# Altium schematic sheet 433_RX.SchDoc
size A4
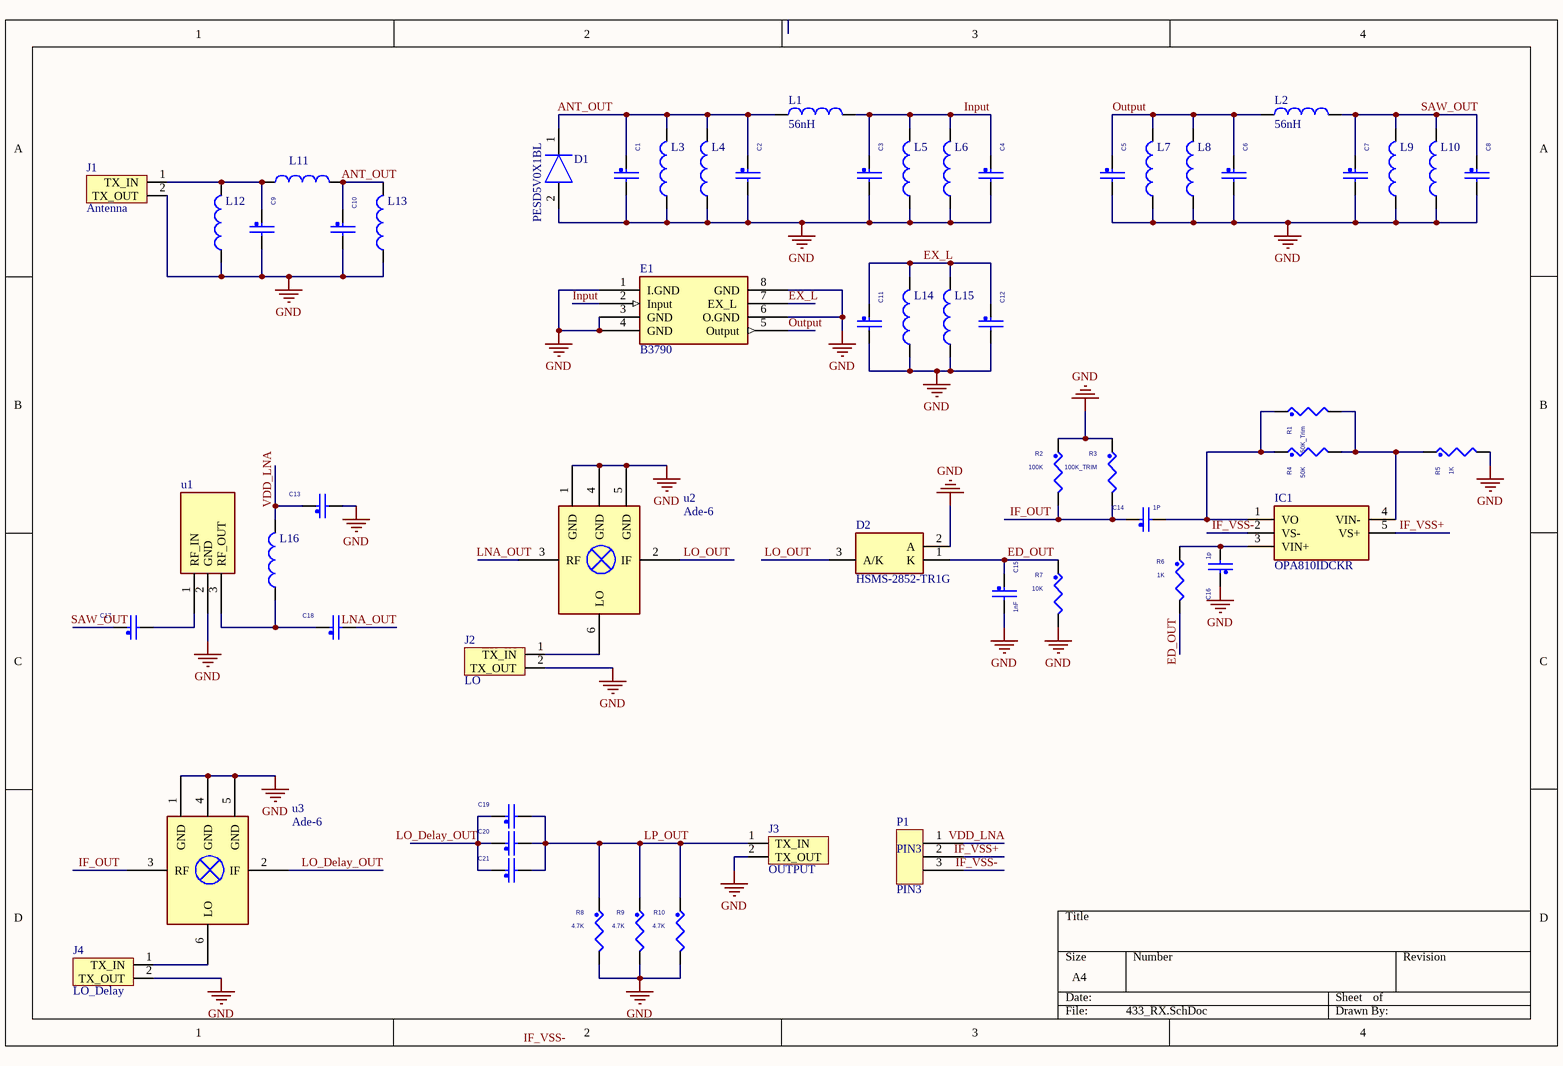
[diagram p0: 433_RX.SchDoc]

## Parts
C1  (no value)  [C0402]
C2  (no value)  [C0402]
C3  (no value)  [C0402]
C4  (no value)  [C0402]
C5  (no value)  [C0402]
C6  (no value)  [C0402]
C7  (no value)  [C0402]
C8  (no value)  [C0402]
C9  (no value)  [C0402]
C10  (no value)  [C0402]
C11  (no value)  [C0402]
C12  (no value)  [C0402]
C13  (no value)  [C0402]
C14  1P  [C0402]
C15  1nF  [C0402]
C16  1p  [C0402]
C17  (no value)  [C0402]
C18  (no value)  [C0402]
C19  (no value)  [C0402]
C20  (no value)  [C0402]
C21  (no value)  [C0402]
D1  PESD5V0X1BL  [PESD5V0X1BL]
D2  HSMS-2852-TR1G  [SOT65P210X110-3N]
E1  B3790  [B3790]
IC1  OPA810IDCKR  [SOT65P210X110-5N]
J1  Antenna  [SMA-2]
J2  LO  [SMA-2]
J3  OUTPUT  [SMA-2]
J4  LO_Delay  [SMA-2]
L1  56nH  [0402-A]
L2  56nH  [0402-A]
L3  (no value)  [0402-A]
L4  (no value)  [0402-A]
L5  (no value)  [0402-A]
L6  (no value)  [0402-A]
L7  (no value)  [0402-A]
L8  (no value)  [0402-A]
L9  (no value)  [0402-A]
L10  (no value)  [0402-A]
L11  56nH  [0402-A]  (value not drawn)
L12  (no value)  [0402-A]
L13  (no value)  [0402-A]
L14  (no value)  [0402-A]
L15  (no value)  [0402-A]
L16  (no value)  [0402-A]
P1  PIN3  [PIN3]
R1  50K_Trim  [R0402]
R2  100K  [R0402]
R3  100K_TRIM  [R0402]
R4  50K  [R0402]
R5  1K  [R0402]
R6  1K  [R0402]
R7  10K  [R0402]
R8  4.7K  [R0402]
R9  4.7K  [R0402]
R10  4.7K  [R0402]
u1  1  [TOP3M9008]  (value not drawn)
u2  Ade-6  [Ade-6]
u3  Ade-6  [Ade-6]

## Nets
GND: C1.2 C2.2 C3.2 C4.2 C5.2 C6.2 C7.2 C8.2 C9.2 C10.2 C11.2 C12.2 C13.2 C15.2 C16.1 D1.2(A) D2.2(A) E1.1(I.GND) E1.3(GND) E1.4(GND) E1.6(O.GND) E1.8(GND) J1.2(TX_OUT) J2.2(TX_OUT) J3.2(TX_OUT) J4.2(TX_OUT) L3.1 L4.1 L5.1 L6.1 L7.1 L8.1 L9.1 L10.1 L12.1 L13.1 L14.1 L15.1 R2.1 R3.1 R5.2 R7.2 R8.2 R9.2 R10.2 u1.2(GND) u2.1(GND) u2.4(GND) u2.5(GND) u3.1(GND) u3.4(GND) u3.5(GND)
ANT_OUT: C1.1 C2.1 C10.1 D1.1(K) L1.1 L3.2 L4.2 L11.2 L13.2
ED_OUT: C15.1 D2.1(K) R6.2 R7.1
EX_L: C11.1 C12.1 E1.7(EX_L) L14.2 L15.2
IF_OUT: C14.1 R2.2 R3.2 u3.3(RF)
IF_VSS+: IC1.5(VS+) P1.2
IF_VSS-: IC1.2(VS-) P1.3
Input: C3.1 C4.1 E1.2(Input) L1.2 L5.2 L6.2
LNA_OUT: C18.2 u2.3(RF)
LO_Delay_OUT: C19.1 C20.1 C21.1 u3.2(IF)
LO_OUT: D2.3(A/K) u2.2(IF)
LP_OUT: C19.2 C20.2 C21.2 J3.1(TX_IN) R8.1 R9.1 R10.1
Output: C5.1 C6.1 E1.5(Output) L2.1 L7.2 L8.2
SAW_OUT: C7.1 C8.1 C17.1 L2.2 L9.2 L10.2
VDD_LNA: C13.1 L16.2 P1.1
NetC9_1: C9.1 J1.1(TX_IN) L11.1 L12.2
NetC14_2: C14.2 IC1.1(VO) R1.1 R4.1
NetC16_2: C16.2 IC1.3(VIN+) R6.1
NetC17_2: C17.2 u1.1(RF_IN)
NetC18_1: C18.1 L16.1 u1.3(RF_OUT)
NetIC1_4: IC1.4(VIN-) R1.2 R4.2 R5.1
NetJ2_1: J2.1(TX_IN) u2.6(LO)
NetJ4_1: J4.1(TX_IN) u3.6(LO)

## Notes on the sheet
- Labels drawn without touching a wire or pin: IF_VSS-

## Library data of the parts
C1-C21 = CAP_NP: CAP CER 0.1UF 10V 10% X5R 0402; CLASS: DISCRETE; FPLIST: CC0402_25,CC0402_HD,0402_CC; CAD_APPROVED: Yes; MFG_PN01: C0402C104K8PAC; MFG_NAME01: KEMET; AGILE_PN: 150-75634; VOLTAGE: 10V; HEIGHT: 0.64MM; ROHS: Yes; Tolerance: 10%
D1 = PESD5V0X1BL: Diode; Manufacturer_Name: NXP; Datasheet Link: https://datasheet.datasheetarchive.com/originals/distributors/Datasheets-NXP/DSANXP010006370.pdf; Height: 0.5mm; Manufacturer_Part_Number: PESD5V0X1BL
D2 = HSMS-2852-TR1G: Diode; Manufacturer_Name: Avago Technologies; Datasheet Link: https://componentsearchengine.com/Datasheets/2/HSMS-2852-TR1G.pdf; Height: 1.1mm; Manufacturer_Part_Number: HSMS-2852-TR1G; Mouser Part Number: 630-HSMS-2852-TR1G; Mouser Price/Stock: https://www.mouser.com/Search/Refine.aspx?Keyword=630-HSMS-2852-TR1G
IC1 = OPA810IDCKR: Integrated Circuit; Manufacturer_Name: Texas Instruments; Datasheet Link: https://eu.mouser.com/ProductDetail/Texas-Instruments/OPA810IDCKR?qs=W%2FMpXkg%252BdQ4VmPwYW7coEA%3D%3D; Height: 1.1mm; Manufacturer_Part_Number: OPA810IDCKR; Mouser Part Number: 595-OPA810IDCKR; Mouser Price/Stock: https://www.mouser.co.uk/ProductDetail/Texas-Instruments/OPA810IDCKR?qs=W%2FMpXkg%252BdQ4VmPwYW7coEA%3D%3D
J1-J4 = SMA-2
L1-L16 = Inductor: Code_IEC: 1005; Published: 8-Jun-2000; LatestRevisionDate: 29-May-2009; LatestRevisionNote: IPC-7351 Footprint Added.; PackageReference: 0402-A; Publisher: Altium Limited; PackageDescription: Chip Inductor; Code_JEITA: 0402
R1-R10 = RES: RES MF 1.0M 1/10W 5% 0402; CLASS: DISCRETE; AGILE_PN: 470-79978; MFG_NAME01: PANASONIC; MFG_PN01: ERJ-2GEJ105X; CAD_APPROVED: Yes; FPLIST: RC0402_25,RC0402_HD,0402_CC; HEIGHT: 0.4MM; Tolerance: 5%; ROHS: Yes
u1 = TQP3M9008